# Altium schematic sheet CPU.SchDoc
size A4
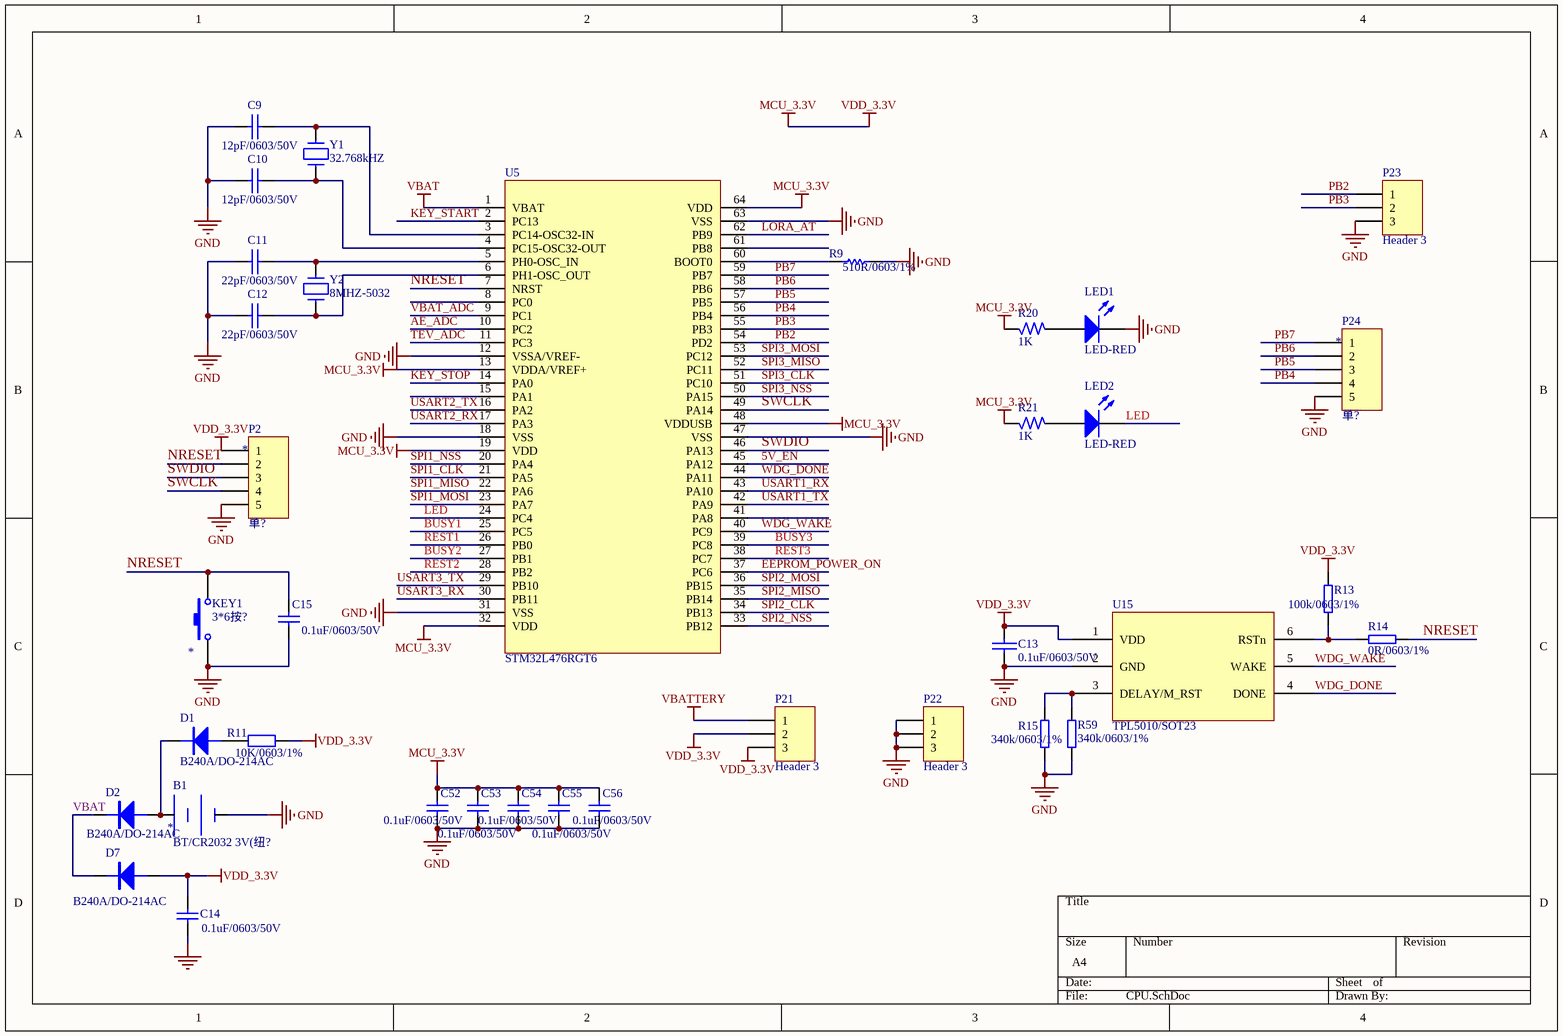
[diagram p0: CPU.SchDoc]

## Parts
B1  *  [LI1220_1]
C9  12pF/0603/50V  [0603]
C10  12pF/0603/50V  [0603]
C11  22pF/0603/50V  [0603]
C12  22pF/0603/50V  [0603]
C13  0.1uF/0603/50V  [0603]
C14  0.1uF/0603/50V  [0603]
C15  0.1uF/0603/50V  [0603]
C52  0.1uF/0603/50V  [0603]
C53  0.1uF/0603/50V  [0603]
C54  0.1uF/0603/50V  [0603]
C55  0.1uF/0603/50V  [0603]
C56  0.1uF/0603/50V  [0603]
D1  B240A/DO-214AC  [DO-214AC]
D2  B240A/DO-214AC  [DO-214AC]
D7  B240A/DO-214AC  [DO-214AC]
KEY1  *  [KEY-3X6mm]
LED1  LED-RED  [LED-0603]
LED2  LED-RED  [LED-0603]
P2  *  [HDR1X5]
P21  Header 3  [HDR1X3]
P22  Header 3  [HDR1X3]
P23  Header 3  [HDR1X3]
P24  *  [HDR1X5]
R9  510R/0603/1%  [0603]
R11  10K/0603/1%  [0603]
R13  100k/0603/1%  [0603]
R14  0R/0603/1%  [0603]
R15  340k/0603/1%  [0603]
R20  1K  [R-0603]
R21  1K  [R-0603]
R59  340k/0603/1%  [0603]
U5  STM32L476RGT6  [LQFP-64-10X10-0.5]
U15  TPL5010/SOT23  [SOT23-6]
Y1  32.768kHZ  [32.768K]
Y2  8MHZ-5032  [XAL]

## Nets
GND: B1.2 C9.1 C10.1 C11.1 C12.1 C13.2 C14.1 C15.1 C52.1 C53.1 C54.1 C55.1 C56.1 KEY1.1 LED1.2(K) P2.5 P22.1 P22.2 P22.3 P23.3 P24.5 R9.2 R15.1 R59.1 U5.12(VSSA/VREF-) U5.18(VSS) U5.31(VSS) U5.47(VSS) U5.63(VSS) U15.2(GND)
MCU_3.3V: C13.1 C14.2 C52.2 C53.2 C54.2 C55.2 C56.2 D7.1(A) P2.1 P21.2 P21.3 R11.1 R13.2 R20.1 R21.1 U5.13(VDDA/VREF+) U5.19(VDD) U5.32(VDD) U5.48(VDDUSB) U5.64(VDD) U15.1(VDD)  [also labelled VDD_3.3V]
VBAT: D2.2(K) D7.2(K) U5.1(VBAT)
VBATTERY: P21.1
5V_EN: U5.45(PA12)
AE_ADC: U5.10(PC2)
BUSY1: U5.25(PC5)
BUSY2: U5.27(PB1)
BUSY3: U5.39(PC8)
EEPROM_POWER_ON: U5.37(PC6)
KEY_START: U5.2(PC13)
KEY_STOP: U5.14(PA0)
LED: LED2.2(K) U5.24(PC4)
LORA_AT: U5.62(PB9)
NRESET: C15.2 KEY1.2 P2.2 R14.1 U5.7(NRST)
PB2: P23.1 U5.54(PD2)
PB3: P23.2 U5.55(PB3)
PB4: P24.4 U5.56(PB4)
PB5: P24.3 U5.57(PB5)
PB6: P24.2 U5.58(PB6)
PB7: P24.1 U5.59(PB7)
REST1: U5.26(PB0)
REST2: U5.28(PB2)
REST3: U5.38(PC7)
SPI1_CLK: U5.21(PA5)
SPI1_MISO: U5.22(PA6)
SPI1_MOSI: U5.23(PA7)
SPI1_NSS: U5.20(PA4)
SPI2_CLK: U5.34(PB13)
SPI2_MISO: U5.35(PB14)
SPI2_MOSI: U5.36(PB15)
SPI2_NSS: U5.33(PB12)
SPI3_CLK: U5.51(PC10)
SPI3_MISO: U5.52(PC11)
SPI3_MOSI: U5.53(PC12)
SPI3_NSS: U5.50(PA15)
SWCLK: P2.4 U5.49(PA14)
SWDIO: P2.3 U5.46(PA13)
TEV_ADC: U5.11(PC3)
USART1_RX: U5.43(PA10)
USART1_TX: U5.42(PA9)
USART2_RX: U5.17(PA3)
USART2_TX: U5.16(PA2)
USART3_RX: U5.30(PB11)
USART3_TX: U5.29(PB10)
VBAT_ADC: U5.9(PC1)
WDG_DONE: U5.44(PA11) U15.4(DONE)
WDG_WAKE: U5.40(PC9) U15.5(WAKE)
NetB1_1: B1.1 D1.2(K) D2.1(A)
NetC9_2: C9.2 U5.3(PC14-OSC32-IN) Y1.1
NetC10_2: C10.2 U5.4(PC15-OSC32-OUT) Y1.2
NetC11_2: C11.2 U5.5(PH0-OSC_IN) Y2.2
NetC12_2: C12.2 U5.6(PH1-OSC_OUT) Y2.1
NetD1_1: D1.1(A) R11.2
NetLED1_1: LED1.1(A) R20.2
NetLED2_1: LED2.1(A) R21.2
NetR9_1: R9.1 U5.60(BOOT0)
NetR13_1: R13.1 R14.2 U15.6(RSTn)
NetR15_2: R15.2 R59.2 U15.3(DELAY/M_RST)

Not connected (* = marked no-connect by the designer): U5 8(PC0) 15(PA1) 41(PA8) 61(PB8)

## Notes on the sheet
- (in symbol Header 5) 单?
- (in symbol SW-PB) 3*6按?
- (in symbol VBAT) BT/CR2032 3V(纽?

## Library data of the parts
B1 = VBAT
C9-C13 = CAP: Capacitor
C14 = Cap: Capacitor; Published: 8-Jun-2000; Revision: July-2002: Re-released for DXP Platform.; Publisher: Altium Limited
C15 C52-C56 = Cap: Capacitor; Value: 104; Published: 8-Jun-2000; LatestRevisionDate: 17-Jul-2002; LatestRevisionNote: Re-released for DXP Platform.; PackageReference: RAD-0.3; Publisher: Altium Limited
D1 D2 D7 = DIODE
KEY1 = SW-PB: Switch; Published: 24-Mar-1999; LatestRevisionDate: 17-Jul-2002; LatestRevisionNote: Re-released for DXP Platform.; PackageReference: SPST-2; Publisher: Altium Limited
LED1 LED2 = LED-RED-0603: LED-RED,5V,30mA,90mW,1.6*0.8mm; 制造商: FHSELECTRON; 公司编号: *; 制造商编号: *
P2 P24 = Header 5: Header, 5-Pin; LatestRevisionDate: 17-Jul-2002; LatestRevisionNote: Re-released for DXP Platform.; Publisher: Altium Limited
P21-P23 = Header 3: Header, 3-Pin; LatestRevisionDate: 17-Jul-2002; LatestRevisionNote: Re-released for DXP Platform.; Publisher: Altium Limited
R9 = RES: Resistor; Value: 510R
R11 = Res Semi: Semiconductor Resistor; Value: 0; Published: 8-Jun-2000; Revision: July-2002: Re-released for DXP Platform.; Publisher: Altium Limited
R13-R15 R59 = RES
R20 R21 = RES-1K-1%-0603: RES,1K,1/10W,1%,0603; 制造商: murata,samsung,国巨; 公司编号: *; 制造商编号: *
U5 = STM32L476R
U15 = TPL5
Y1 Y2 = CRYSTAL